# EAGLE design power (EAGLE 9.2.1)
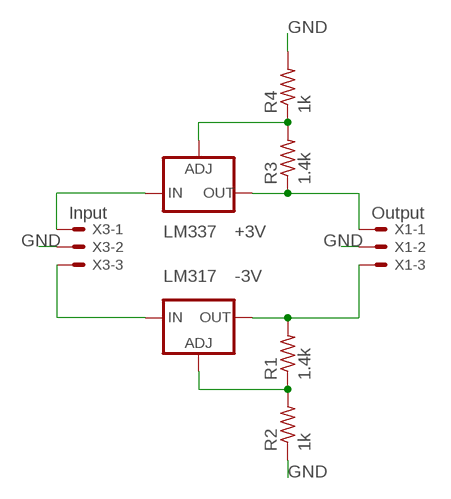
[diagram p0: schematic, sheet 1]

## Parts
LM317  -3V  LM317TL  [317TL]
LM337  +3V  LM337TL  [337TL]
R1  1.4k  R-US_0204/7  [0204/7]
R2  1k  R-US_0204/7  [0204/7]
R3  1.4k  R-US_0204/7  [0204/7]
R4  1k  R-US_0204/7  [0204/7]
X1  Output  22-23-2031  [22-23-2031]
X3  Input  22-23-2031  [22-23-2031]

## Nets
GND: R2.1 R4.2 X1.2 X3.2
N$1: LM317.2(OUT) R1.2 X1.3
N$2: LM337.3(OUT) R3.1 X1.1
N$3: LM337.2(IN) X3.1
N$4: LM317.3(IN) X3.3
N$5: LM337.1(ADJ) R3.2 R4.1
N$6: LM317.1(ADJ) R1.1 R2.2

## Library data of the parts
LM317 = v-reg:LM317TL: VOLTAGE REGULATOR
LM337 = v-reg:LM337TL: VOLTAGE REGULATOR
R1-R4 = resistor:R-US_: RESISTOR, American symbol
X1 X3 = con-molex:22-23-2031: .100" (2.54mm) Center Header - 3 Pin; MF: MOLEX; MPN: 22-23-2031; OC_FARNELL: 1462950; OC_NEWARK: 30C0862

## Board
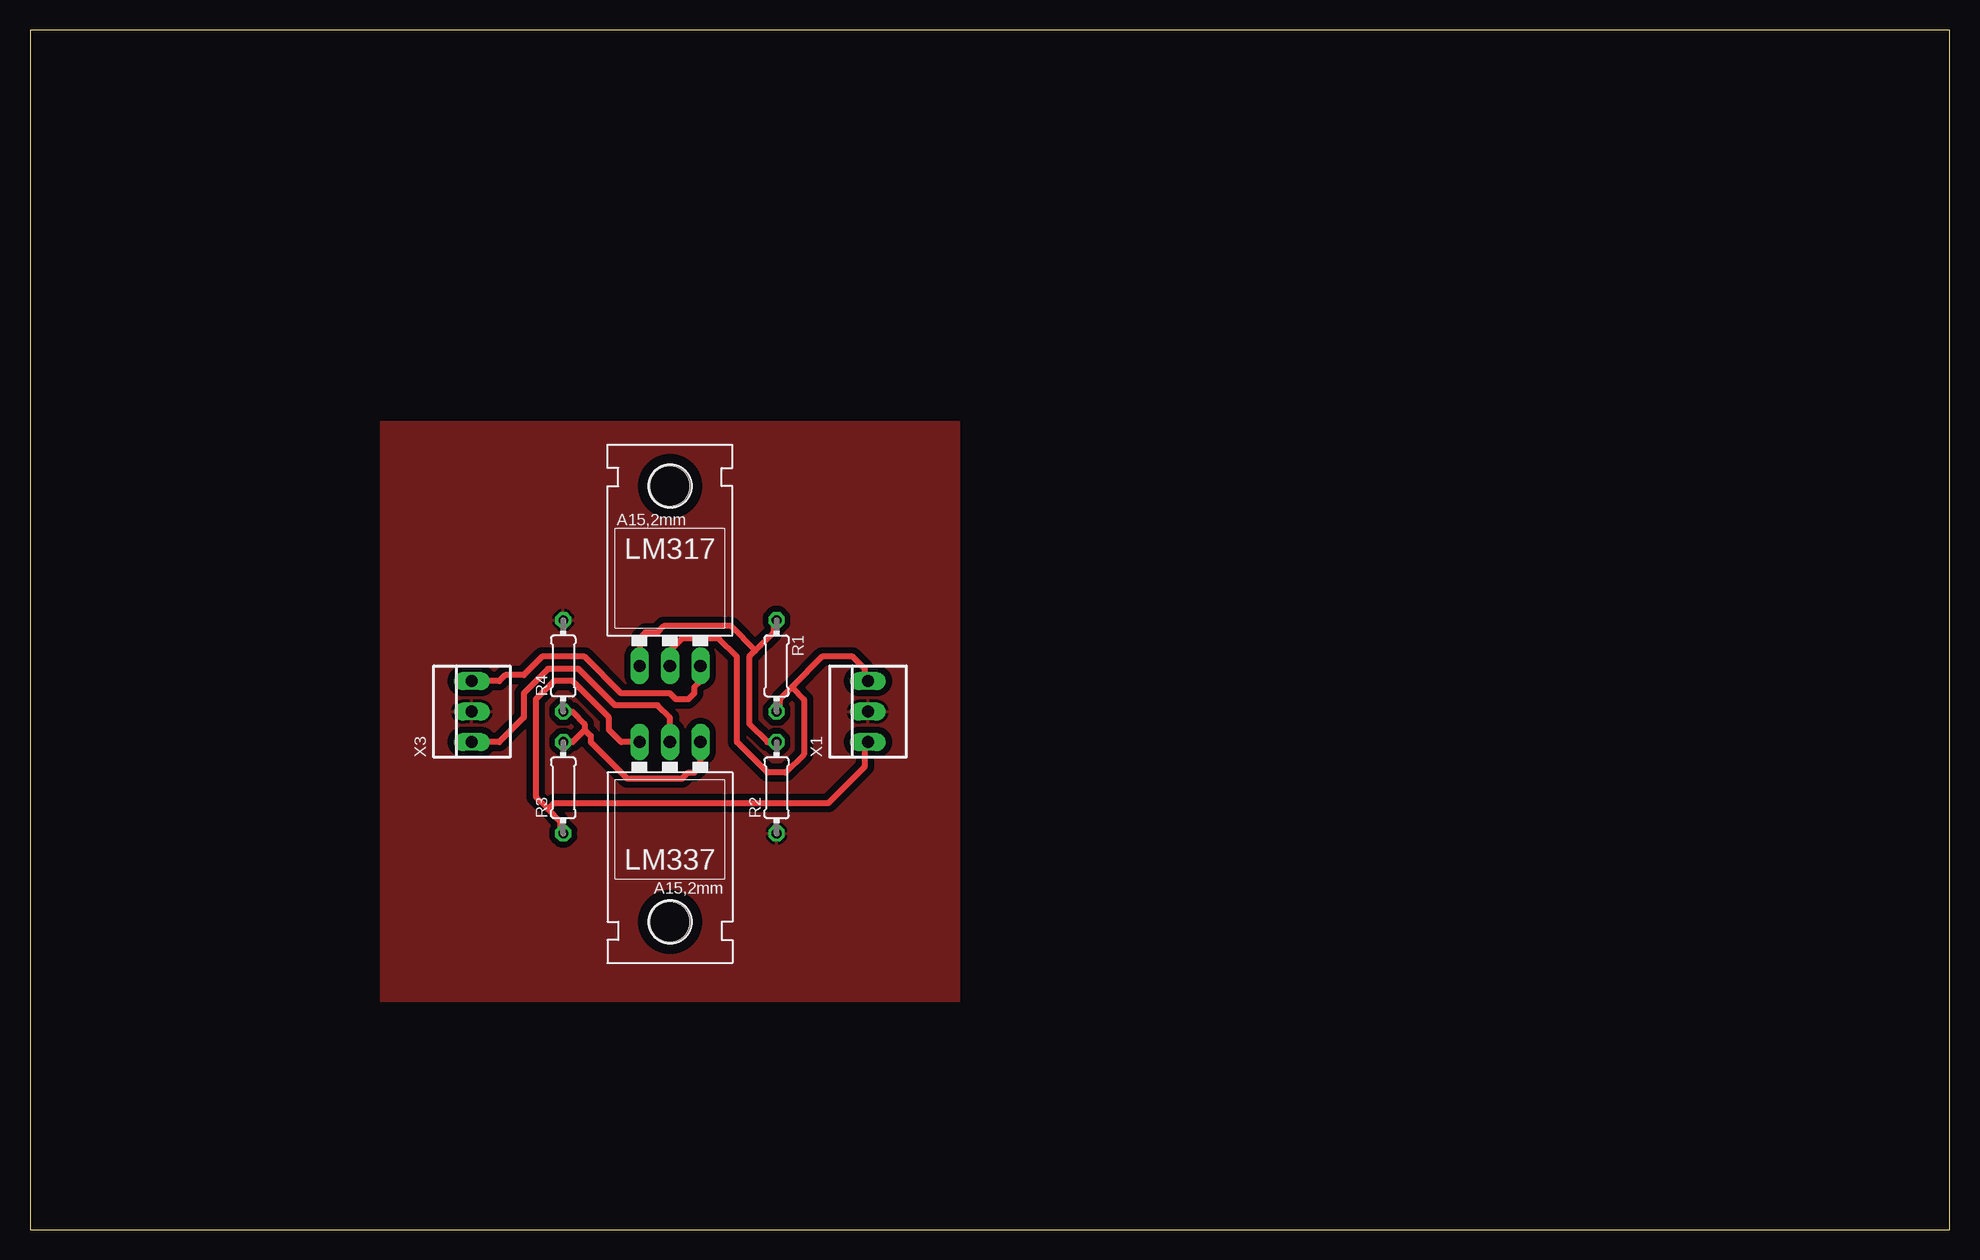
[diagram p1: board, top side]

Size 160 x 100 mm. Coordinates in mm from the lower left corner, seen from the top.
Outline: 0,0 160,0 160,100 0,100 0,0
Copper layers (1*16): Top 0.035mm / dielectric 1.5mm / Bottom 0.035mm
Design rules "default *": minimum track width 20mil, minimum drill 0.35mm, track to track 20mil, track to pad 20mil, pad to pad 6mil, via to via 6mil, smd to smd 6mil, copper to edge 40mil, drill to drill 6mil, minimum pad ring 10mil, minimum via ring 8mil, stop-mask expansion 4mil, vias tented up to drill 0mil, thermal gap 10mil

### Footprints (pad centres in the part's own frame; a part is rotated, then mirrored left to right if it is on the bottom)
317TL = drill 1.016 long: 1 -2.54,-3.81; 2 0,-3.81; 3 2.54,-3.81 | hole 3.302: 0,11.176
337TL = drill 1.016 long: 1 -2.54,-3.81; 2 0,-3.81; 3 2.54,-3.81 | hole 3.302: 0,11.176
0204/7 = drill 0.813 octagon: 1 -3.81,0; 2 3.81,0
22-23-2031 = drill 1 long: 1 -2.54,0; 2 0,0; 3 2.54,0

### Placement (x,y rotation side)
LM317  53.34,50.8 0 top
LM337  53.34,36.83 180 top
R1  62.23,46.99 270 top
R2  62.23,36.83 90 top
R3  44.45,36.83 90 top
R4  44.45,46.99 90 top
X1  69.85,43.18 90 top
X3  36.83,43.18 90 top

### Tracks (layer width: path | path; a pad name or v marks a point on that pad's centre or on a via)
GND
  pour Top: 29.21,67.31 29.21,19.05 77.47,19.05 77.47,67.31
N$1
  Top 0.508: 63.5,45.21 66.04,47.75 68.58,47.75 69.6,46.74 69.6,45.72 X1.3 | 63.5,45.21 62.48,44.2 62.48,43.18 R1.2 | LM317.2 53.34,48.26 54.36,49.28 57.4,49.28 58.93,47.75 58.93,40.64 61.47,38.1 62.99,38.1 64.52,39.62 64.52,44.2 63.5,45.21
N$2
  Top 0.508: 43.18,35.05 42.16,36.07 42.16,44.2 43.69,45.72 45.21,45.72 48.26,42.67 48.26,41.66 49.28,40.64 LM337.3 | 43.18,35.05 44.2,34.04 44.2,33.02 R3.1 | 43.18,35.05 43.69,35.56 66.55,35.56 69.6,38.61 69.6,40.64 X1.1
N$3
  Top 0.508: X3.1 39.12,40.64 41.15,42.67 41.15,44.7 43.18,46.74 45.72,46.74 48.77,43.69 52.32,43.69 53.34,42.67 LM337.2
N$4
  Top 0.508: X3.3 39.12,45.72 39.62,46.23 41.15,46.23 42.67,47.75 46.23,47.75 49.28,44.7 53.34,44.7 53.85,44.2 54.86,44.2 55.37,44.7 55.37,45.21 55.88,45.72 LM317.3
N$5
  Top 0.508: R3.2 45.21,40.64 46.23,41.66 | 46.23,41.66 46.23,42.16 45.21,43.18 R4.1 | LM337.1 55.88,38.61 55.37,38.1 54.86,38.1 54.36,37.59 49.78,37.59 46.74,40.64 46.74,41.15 46.23,41.66
N$6
  Top 0.508: R2.2 61.47,40.64 59.94,42.16 59.94,47.75 60.45,48.26 | 60.45,48.26 61.98,49.78 61.98,50.8 R1.1 | LM317.1 50.8,49.28 51.31,49.78 52.32,49.78 52.83,50.29 58.42,50.29 60.45,48.26